# EAGLE design powerSupplyBoard_new (EAGLE 8.0.0)
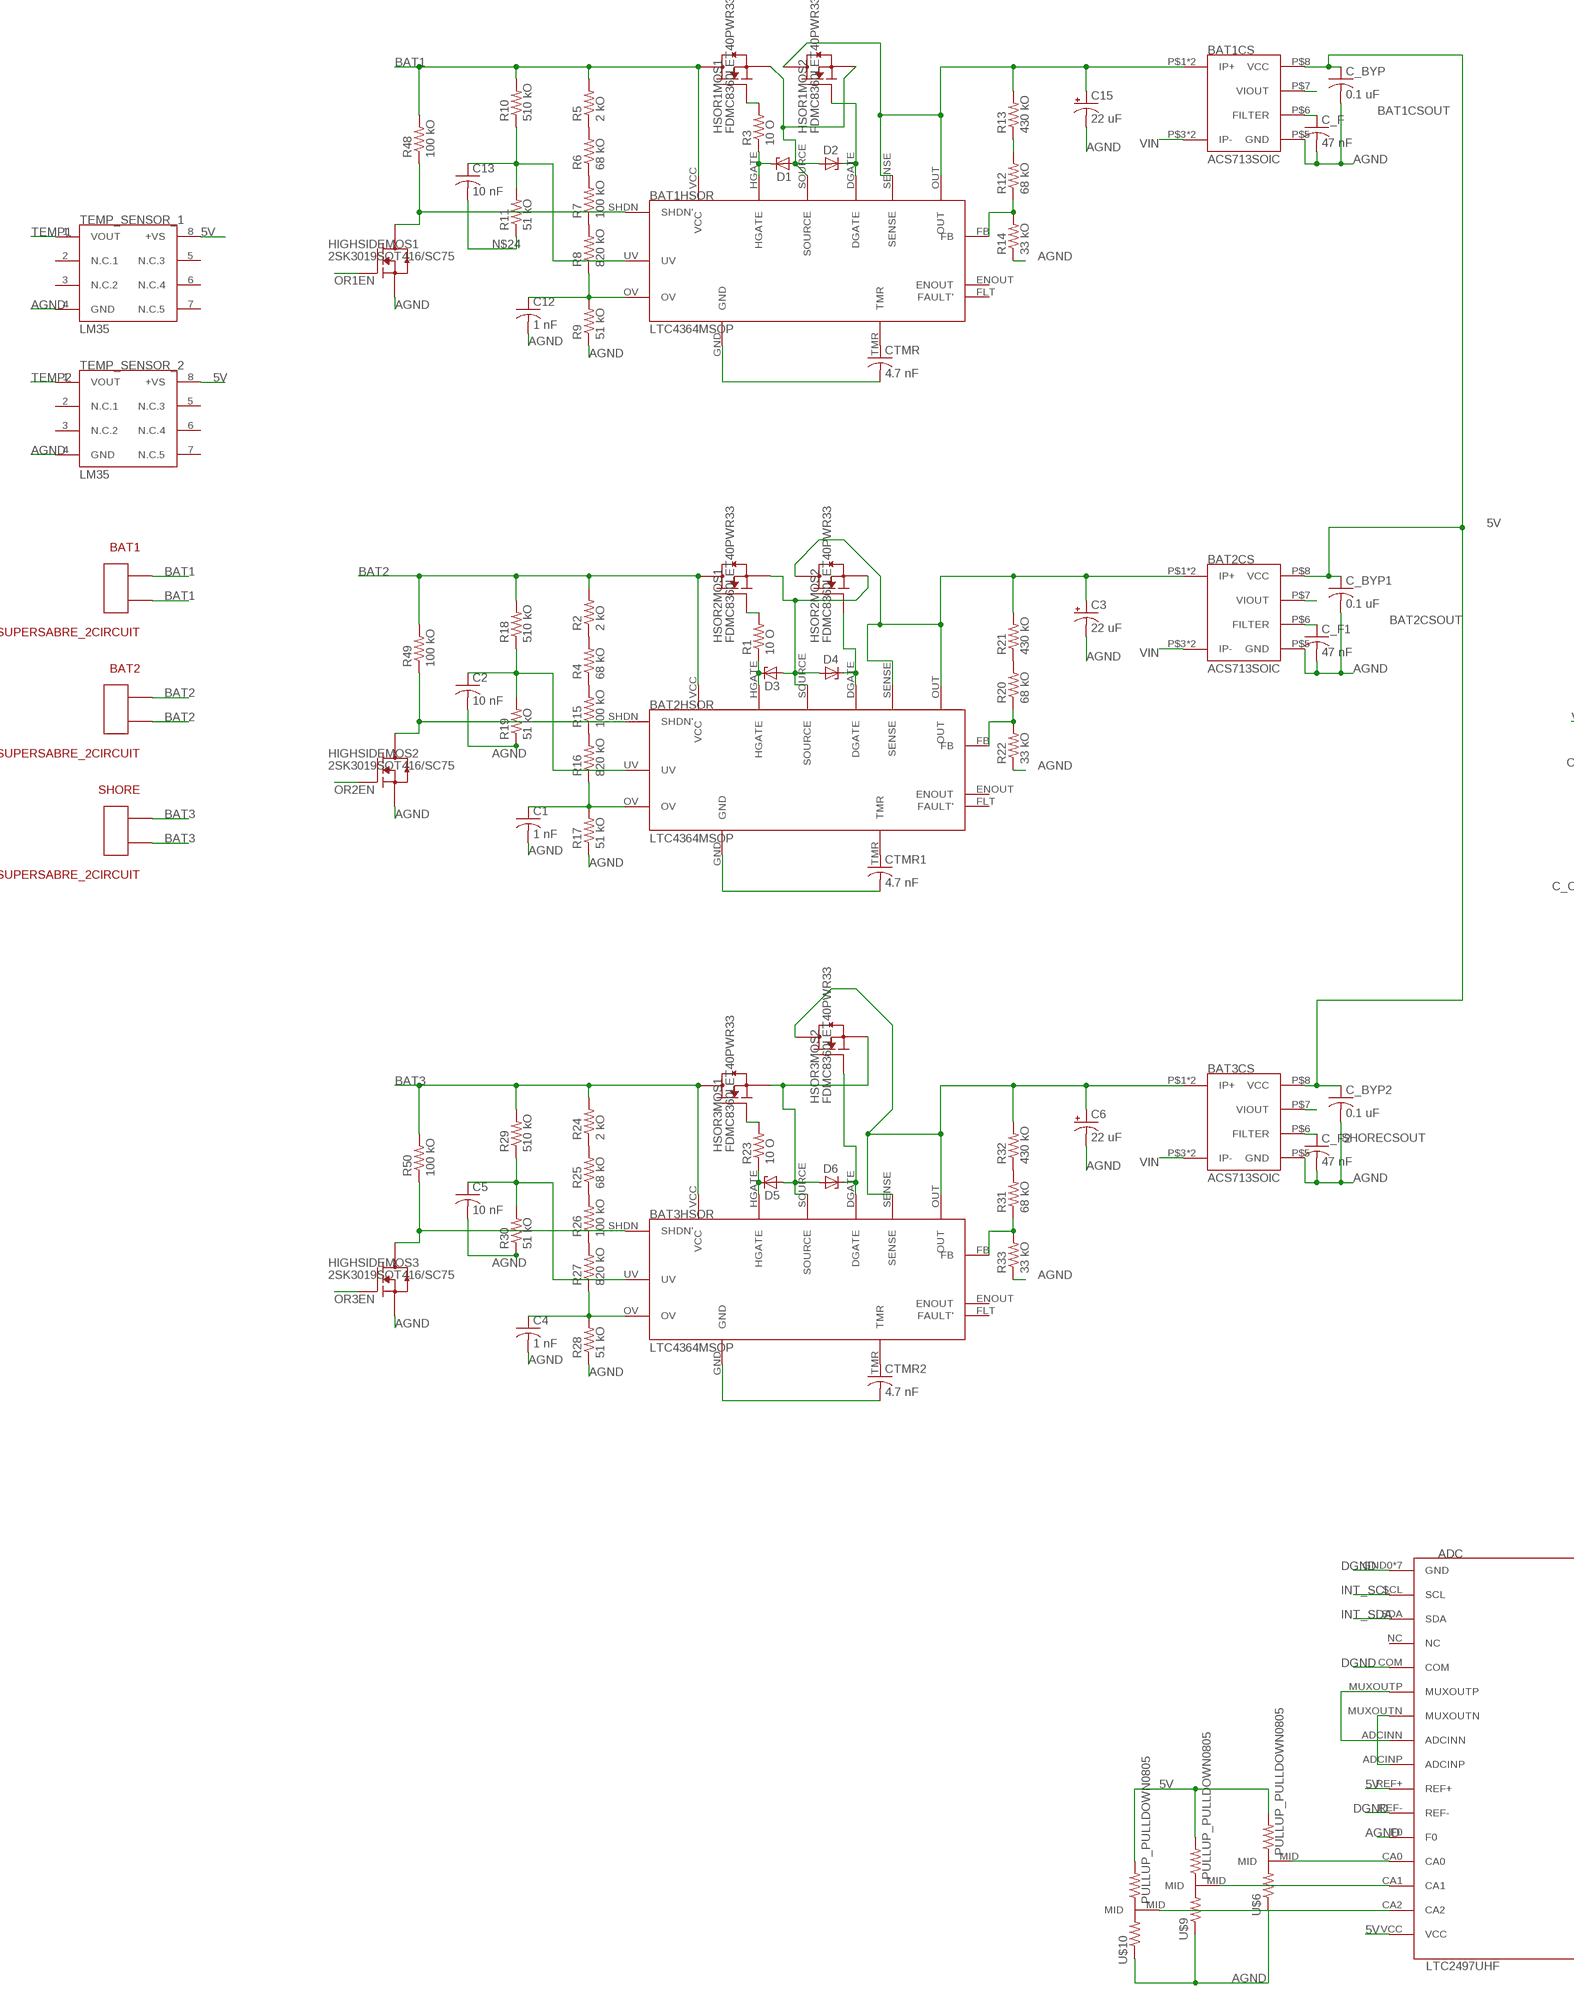
[diagram p0: schematic, sheet 1, part 1 of 2]
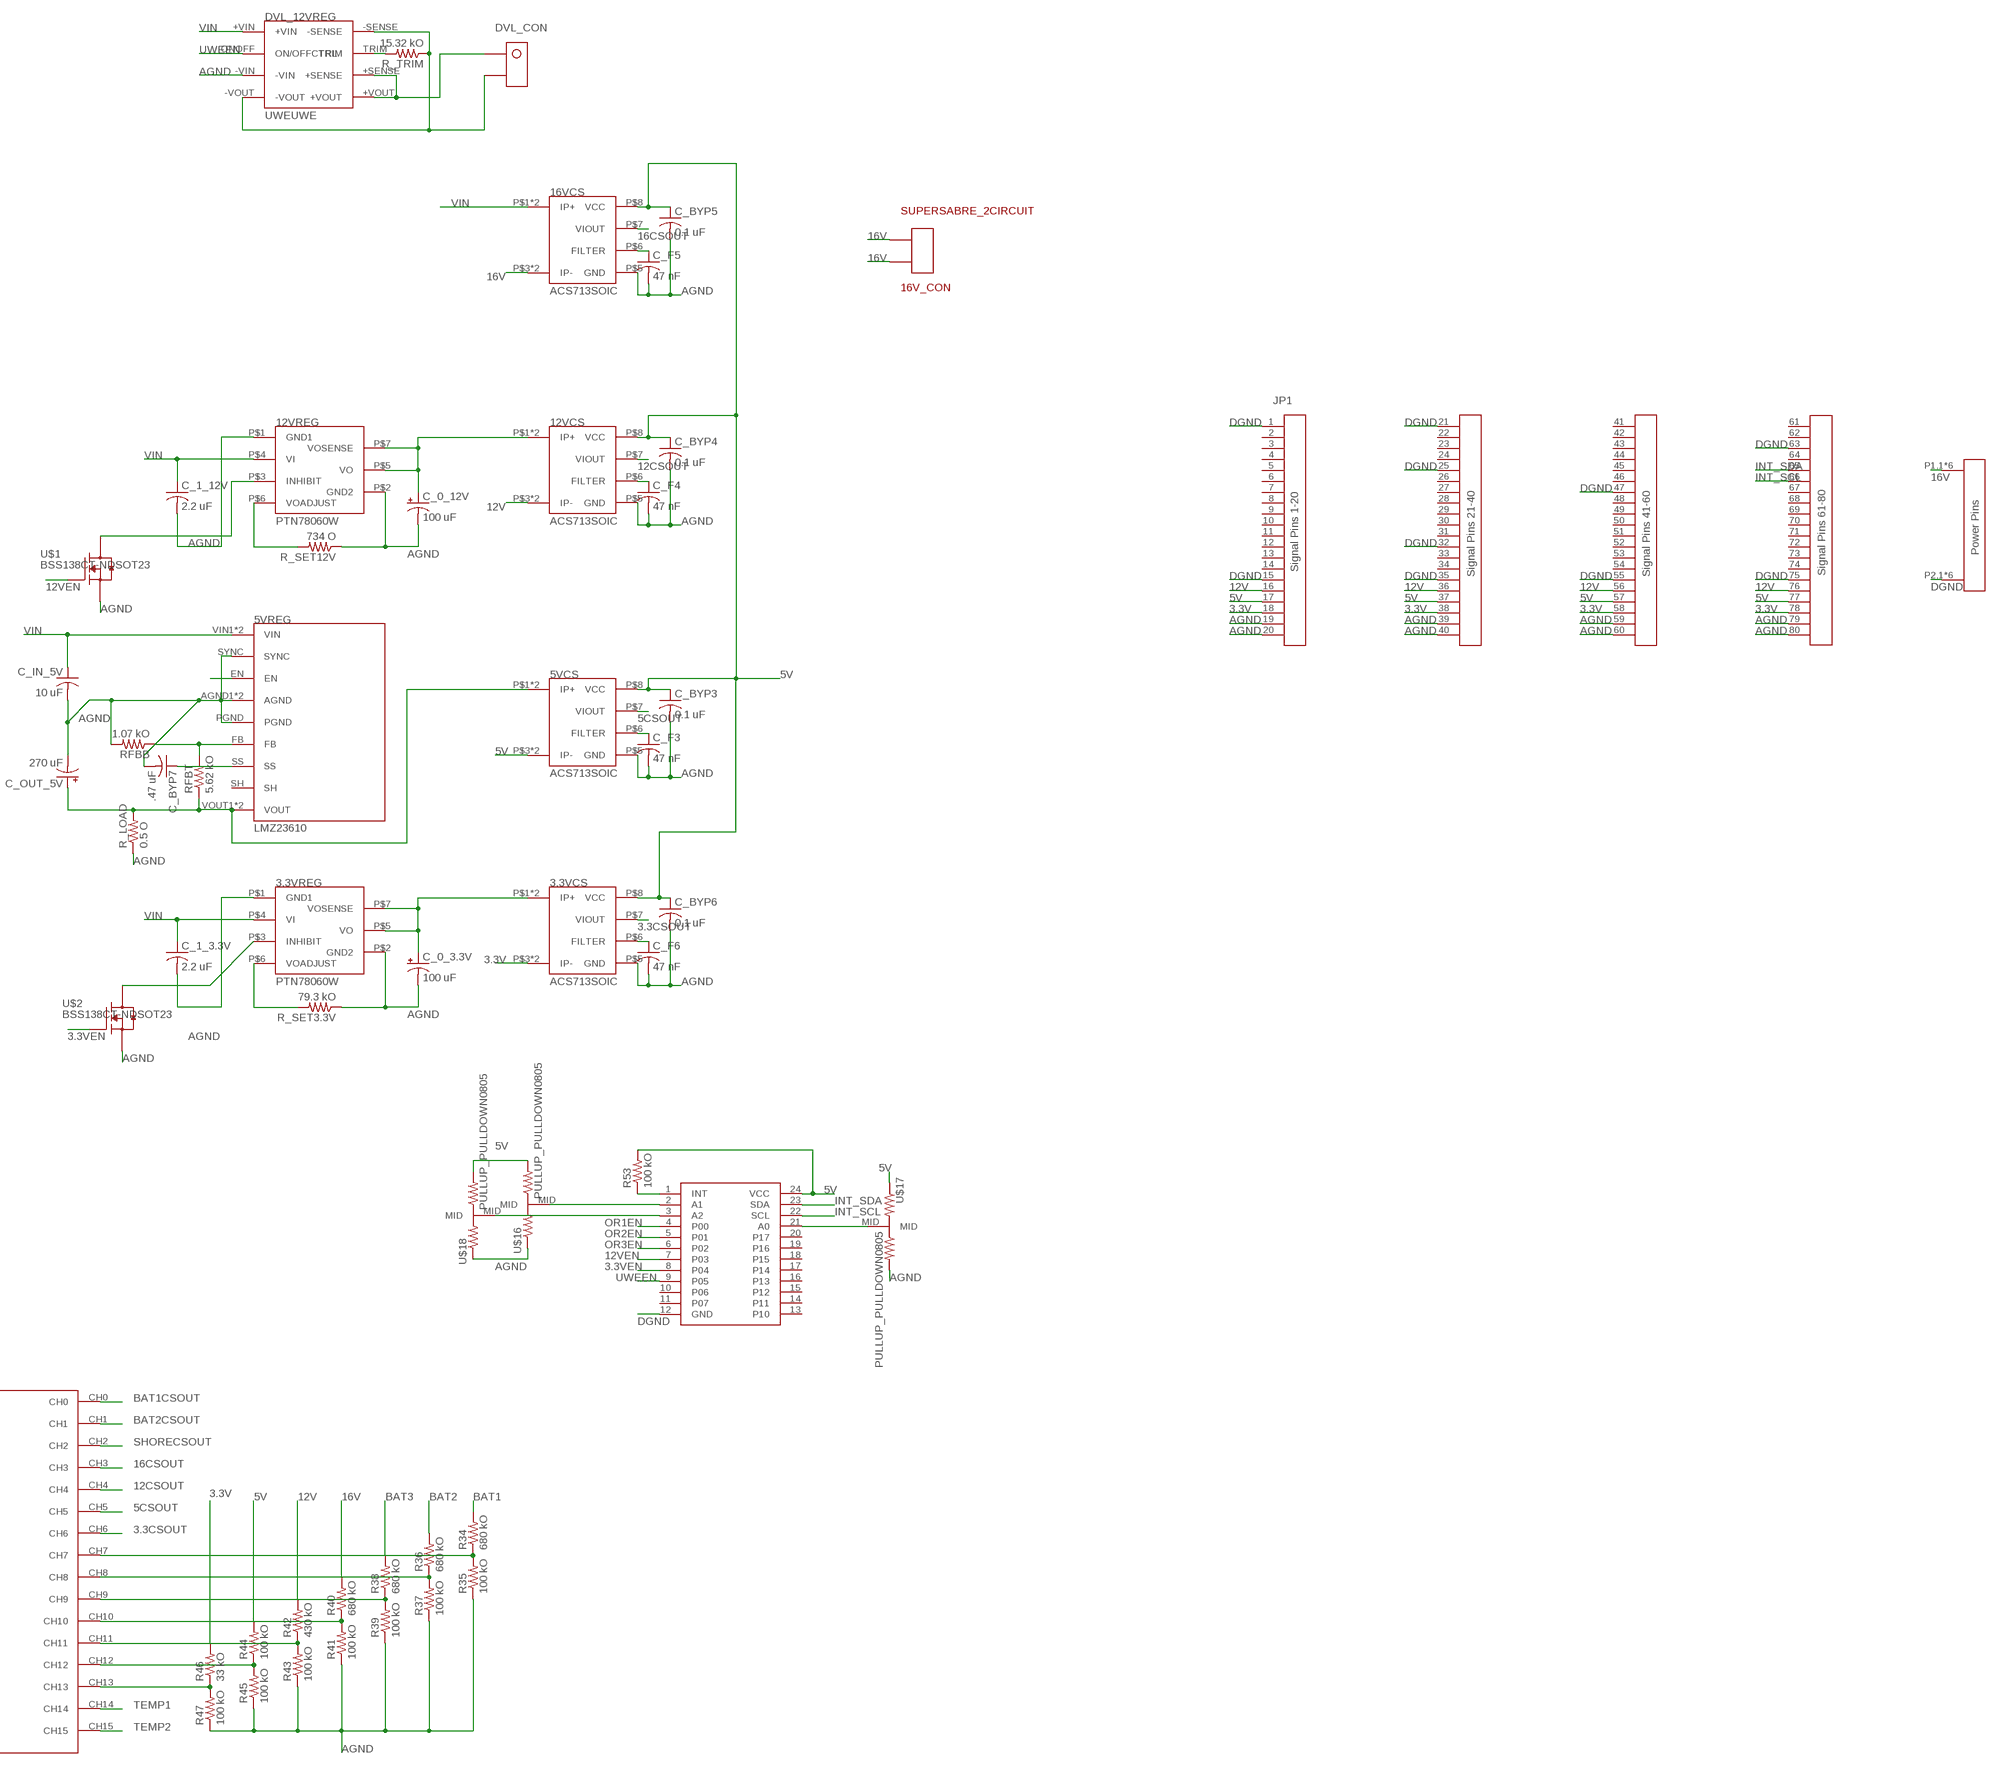
[diagram p1: schematic, sheet 1, part 2 of 2]

## Parts
3.3VCS  ACS713SOIC  [ACS713-SOIC]
3.3VREG  PTN78060W  [PTN78060W]
5VCS  ACS713SOIC  [ACS713-SOIC]
5VREG  LMZ23610  [LMZ23610]
12VCS  ACS713SOIC  [ACS713-SOIC]
12VREG  PTN78060W  [PTN78060W]
16V_CON  SUPERSABRE_2CIRCUIT  [SUPERSABRE_2CIRCUIT]
16VCS  ACS713SOIC  [ACS713-SOIC]
ADC  LTC2497UHF  [LTC2497-UHF]
BAT1  SUPERSABRE_2CIRCUIT  [SUPERSABRE_2CIRCUIT]
BAT1CS  ACS713SOIC  [ACS713-SOIC]
BAT1HSOR  LTC4364MSOP  [MSOP16]
BAT2  SUPERSABRE_2CIRCUIT  [SUPERSABRE_2CIRCUIT]
BAT2CS  ACS713SOIC  [ACS713-SOIC]
BAT2HSOR  LTC4364MSOP  [MSOP16]
BAT3CS  ACS713SOIC  [ACS713-SOIC]
BAT3HSOR  LTC4364MSOP  [MSOP16]
C1  1 nF  C-USC0805  [C0805]
C2  10 nF  C-USC0805  [C0805]
C3  22 uF  CPOL-USF  [PANASONIC_F]
C4  1 nF  C-USC0805  [C0805]
C5  10 nF  C-USC0805  [C0805]
C6  22 uF  CPOL-USF  [PANASONIC_F]
C12  1 nF  C-USC0805  [C0805]
C13  10 nF  C-USC0805  [C0805]
C15  22 uF  CPOL-USF  [PANASONIC_F]
C_0_3.3V  100 uF  CPOL-USF  [PANASONIC_F]
C_0_12V  100 uF  CPOL-USF  [PANASONIC_F]
C_1_3.3V  2.2 uF  C-USC0805  [C0805]
C_1_12V  2.2 uF  C-USC0805  [C0805]
C_BYP  0.1 uF  C-USC0805  [C0805]
C_BYP1  0.1 uF  C-USC0805  [C0805]
C_BYP2  0.1 uF  C-USC0805  [C0805]
C_BYP3  0.1 uF  C-USC0805  [C0805]
C_BYP4  0.1 uF  C-USC0805  [C0805]
C_BYP5  0.1 uF  C-USC0805  [C0805]
C_BYP6  0.1 uF  C-USC0805  [C0805]
C_BYP7  .47 uF  C-USC0805  [C0805]
C_F  47 nF  C-USC0805  [C0805]
C_F1  47 nF  C-USC0805  [C0805]
C_F2  47 nF  C-USC0805  [C0805]
C_F3  47 nF  C-USC0805  [C0805]
C_F4  47 nF  C-USC0805  [C0805]
C_F5  47 nF  C-USC0805  [C0805]
C_F6  47 nF  C-USC0805  [C0805]
C_IN_5V  10 uF  C-USC0805  [C0805]
C_OUT_5V  270 uF  CPOL-USF  [PANASONIC_F]
CTMR  4.7 nF  C-USC0805  [C0805]
CTMR1  4.7 nF  C-USC0805  [C0805]
CTMR2  4.7 nF  C-USC0805  [C0805]
D1  ZENER-DIODESOD323-W  [SOD323-W]
D2  ZENER-DIODESOD323-W  [SOD323-W]
D3  ZENER-DIODESOD323-W  [SOD323-W]
D4  ZENER-DIODESOD323-W  [SOD323-W]
D5  ZENER-DIODESOD323-W  [SOD323-W]
D6  ZENER-DIODESOD323-W  [SOD323-W]
DVL_12VREG  UWEUWE  [UWE]
DVL_CON  KK254_VERT_2PIN22-29-2021  [KK254_VERT_2PIN]
HIGHSIDEMOS1  2SK3019SOT416/SC75  [SOT416]
HIGHSIDEMOS2  2SK3019SOT416/SC75  [SOT416]
HIGHSIDEMOS3  2SK3019SOT416/SC75  [SOT416]
HSOR1MOS1  FDMC8360LET40PWR33  [POWER33]
HSOR1MOS2  FDMC8360LET40PWR33  [POWER33]
HSOR2MOS1  FDMC8360LET40PWR33  [POWER33]
HSOR2MOS2  FDMC8360LET40PWR33  [POWER33]
HSOR3MOS1  FDMC8360LET40PWR33  [POWER33]
HSOR3MOS2  FDMC8360LET40PWR33  [POWER33]
IOEXPANDER  PCF8575C  [PW_R-PDSO-G24]
JP1  MPSC-01-80MPSC-RA-LC  [MPSC-01-80]
R1  10 O  R-US_R0805  [R0805]
R2  2 kO  R-US_R0805  [R0805]
R3  10 O  R-US_R0805  [R0805]
R4  68 kO  R-US_R0805  [R0805]
R5  2 kO  R-US_R0805  [R0805]
R6  68 kO  R-US_R0805  [R0805]
R7  100 kO  R-US_R0805  [R0805]
R8  820 kO  R-US_R0805  [R0805]
R9  51 kO  R-US_R0805  [R0805]
R10  510 kO  R-US_R0805  [R0805]
R11  51 kO  R-US_R0805  [R0805]
R12  68 kO  R-US_R0805  [R0805]
R13  430 kO  R-US_R0805  [R0805]
R14  33 kO  R-US_R0805  [R0805]
R15  100 kO  R-US_R0805  [R0805]
R16  820 kO  R-US_R0805  [R0805]
R17  51 kO  R-US_R0805  [R0805]
R18  510 kO  R-US_R0805  [R0805]
R19  51 kO  R-US_R0805  [R0805]
R20  68 kO  R-US_R0805  [R0805]
R21  430 kO  R-US_R0805  [R0805]
R22  33 kO  R-US_R0805  [R0805]
R23  10 O  R-US_R0805  [R0805]
R24  2 kO  R-US_R0805  [R0805]
R25  68 kO  R-US_R0805  [R0805]
R26  100 kO  R-US_R0805  [R0805]
R27  820 kO  R-US_R0805  [R0805]
R28  51 kO  R-US_R0805  [R0805]
R29  510 kO  R-US_R0805  [R0805]
R30  51 kO  R-US_R0805  [R0805]
R31  68 kO  R-US_R0805  [R0805]
R32  430 kO  R-US_R0805  [R0805]
R33  33 kO  R-US_R0805  [R0805]
R34  680 kO  R-US_R0805  [R0805]
R35  100 kO  R-US_R0805  [R0805]
R36  680 kO  R-US_R0805  [R0805]
R37  100 kO  R-US_R0805  [R0805]
R38  680 kO  R-US_R0805  [R0805]
R39  100 kO  R-US_R0805  [R0805]
R40  680 kO  R-US_R0805  [R0805]
R41  100 kO  R-US_R0805  [R0805]
R42  430 kO  R-US_R0805  [R0805]
R43  100 kO  R-US_R0805  [R0805]
R44  100 kO  R-US_R0805  [R0805]
R45  100 kO  R-US_R0805  [R0805]
R46  33 kO  R-US_R0805  [R0805]
R47  100 kO  R-US_R0805  [R0805]
R48  100 kO  R-US_R0805  [R0805]
R49  100 kO  R-US_R0805  [R0805]
R50  100 kO  R-US_R0805  [R0805]
R53  100 kO  R-US_R0805  [R0805]
R_LOAD  0.5 O  R-US_R0805  [R0805]
R_SET3.3V  79.3 kO  R-US_R0805  [R0805]
R_SET12V  734 O  R-US_R0805  [R0805]
R_TRIM  15.32 kO  R-US_R0805  [R0805]
RFBB  1.07 kO  R-US_R0805  [R0805]
RFBT  5.62 kO  R-US_R0805  [R0805]
SHORE  SUPERSABRE_2CIRCUIT  [SUPERSABRE_2CIRCUIT]
TEMP_SENSOR_1  LM35  [LM35]
TEMP_SENSOR_2  LM35  [LM35]
U$1  BSS138CT-NDSOT23  [SOT23]
U$2  BSS138CT-NDSOT23  [SOT23]
U$6  PULLUP_PULLDOWN0805  [PULLUP_PULLDOWN_0805]
U$9  PULLUP_PULLDOWN0805  [PULLUP_PULLDOWN_0805]
U$10  PULLUP_PULLDOWN0805  [PULLUP_PULLDOWN_0805]
U$16  PULLUP_PULLDOWN0805  [PULLUP_PULLDOWN_0805]
U$17  PULLUP_PULLDOWN0805  [PULLUP_PULLDOWN_0805]
U$18  PULLUP_PULLDOWN0805  [PULLUP_PULLDOWN_0805]

## Nets
3.3CSOUT: 3.3VCS.P$7(VIOUT) ADC.CH6
3.3V: 3.3VCS.P$3(IP-) 3.3VCS.P$4(IP-) JP1.18 JP1.38 JP1.58 JP1.78 R46.2
3.3VEN: IOEXPANDER.8(P04) U$2.1(G)
5CSOUT: 5VCS.P$7(VIOUT) ADC.CH5
5V: 3.3VCS.P$8(VCC) 5VCS.P$3(IP-) 5VCS.P$4(IP-) 5VCS.P$8(VCC) 12VCS.P$8(VCC) 16VCS.P$8(VCC) ADC.REF+ ADC.VCC BAT1CS.P$8(VCC) BAT2CS.P$8(VCC) BAT3CS.P$8(VCC) C_BYP1.1 C_BYP2.1 C_BYP3.1 C_BYP4.1 C_BYP5.1 C_BYP6.1 C_BYP.1 IOEXPANDER.24(VCC) JP1.17 JP1.37 JP1.57 JP1.77 R44.2 R53.2 TEMP_SENSOR_1.8(+VS) TEMP_SENSOR_2.8(+VS) U$6.VCC(PWR) U$9.VCC(PWR) U$10.VCC(PWR) U$16.VCC(PWR) U$17.GND U$18.VCC(PWR)
12CSOUT: 12VCS.P$7(VIOUT) ADC.CH4
12V: 12VCS.P$3(IP-) 12VCS.P$4(IP-) JP1.16 JP1.36 JP1.56 JP1.76 R42.2
12VEN: IOEXPANDER.7(P03) U$1.1(G)
16CSOUT: 16VCS.P$7(VIOUT) ADC.CH3
16V: 16V_CON.P$1 16V_CON.P$2 16VCS.P$3(IP-) 16VCS.P$4(IP-) JP1.P1,1(POWER1) JP1.P1,2(POWER1) JP1.P1,3(POWER1) JP1.P1,4(POWER1) JP1.P1,5(POWER1) JP1.P1,6(POWER1) R40.2
AGND: 3.3VCS.P$5(GND) 3.3VREG.P$1(GND1) 3.3VREG.P$2(GND2) 5VCS.P$5(GND) 5VREG.AGND1(AGND) 5VREG.AGND2(AGND) 5VREG.PGND 5VREG.SYNC 12VCS.P$5(GND) 12VREG.P$1(GND1) 12VREG.P$2(GND2) 16VCS.P$5(GND) ADC.F0 BAT1CS.P$5(GND) BAT1HSOR.GND BAT2CS.P$5(GND) BAT2HSOR.GND BAT3CS.P$5(GND) BAT3HSOR.GND C1.2 C2.2 C3.- C4.2 C5.2 C6.- C12.2 C15.- C_0_3.3V.- C_0_12V.- C_1_3.3V.2 C_1_12V.2 C_BYP1.2 C_BYP2.2 C_BYP3.2 C_BYP4.2 C_BYP5.2 C_BYP6.2 C_BYP7.2 C_BYP.2 C_F1.2 C_F2.2 C_F3.2 C_F4.2 C_F5.2 C_F6.2 C_F.2 C_IN_5V.2 C_OUT_5V.- CTMR1.2 CTMR2.2 CTMR.2 DVL_12VREG.-VIN HIGHSIDEMOS1.S HIGHSIDEMOS2.S HIGHSIDEMOS3.S JP1.19 JP1.20 JP1.39 JP1.40 JP1.59 JP1.60 JP1.79 JP1.80 R9.1 R14.1 R17.1 R19.1 R22.1 R28.1 R30.1 R33.1 R35.1 R37.1 R39.1 R41.1 R43.1 R45.1 R47.1 R_LOAD.1 R_SET3.3V.1 R_SET12V.1 RFBB.2 TEMP_SENSOR_1.4(GND) TEMP_SENSOR_2.4(GND) U$1.2(S) U$2.2(S) U$6.GND U$9.GND U$10.GND U$16.GND U$17.VCC(PWR) U$18.GND
BAT1: BAT1.P$1 BAT1.P$2 BAT1HSOR.VCC HSOR1MOS1.DRAIN R5.2 R10.2 R34.2 R48.2
BAT1CSOUT: ADC.CH0 BAT1CS.P$7(VIOUT)
BAT1HSOROUT: BAT1CS.P$1(IP+) BAT1CS.P$2(IP+) BAT1HSOR.OUT BAT1HSOR.SENSE C15.+ HSOR1MOS2.DRAIN R13.2
BAT2: BAT2.P$1 BAT2.P$2 BAT2HSOR.VCC HSOR2MOS1.DRAIN R2.2 R18.2 R36.2 R49.2
BAT2CSOUT: ADC.CH1 BAT2CS.P$7(VIOUT)
BAT2HSOROUT: BAT2CS.P$1(IP+) BAT2CS.P$2(IP+) BAT2HSOR.OUT BAT2HSOR.SENSE C3.+ HSOR2MOS2.DRAIN R21.2
BAT3: BAT3HSOR.VCC HSOR3MOS1.DRAIN R24.2 R29.2 R38.2 R50.2 SHORE.P$1 SHORE.P$2
BAT3HSOROUT: BAT3CS.P$1(IP+) BAT3CS.P$2(IP+) BAT3HSOR.OUT BAT3HSOR.SENSE C6.+ HSOR3MOS2.DRAIN R32.2
DGND: ADC.COM ADC.GND0(GND) ADC.GND1(GND) ADC.GND2(GND) ADC.GND3(GND) ADC.GND4(GND) ADC.GND5(GND) ADC.GND6(GND) ADC.REF- IOEXPANDER.12(GND) JP1.1 JP1.15 JP1.21 JP1.25 JP1.32 JP1.35 JP1.47 JP1.55 JP1.63 JP1.75 JP1.P2,1(POWER2) JP1.P2,2(POWER2) JP1.P2,3(POWER2) JP1.P2,4(POWER2) JP1.P2,5(POWER2) JP1.P2,6(POWER2)
INT_SCL: ADC.SCL IOEXPANDER.22(SCL) JP1.66
INT_SDA: ADC.SDA IOEXPANDER.23(SDA) JP1.65
N$2: BAT2HSOR.HGATE D3.C R1.1
N$3: HSOR1MOS1.GATE R3.2
N$4: BAT2HSOR.DGATE D4.C HSOR2MOS2.GATE
N$6: R2.1 R4.2
N$7: BAT1HSOR.HGATE D1.C R3.1
N$8: R5.1 R6.2
N$9: BAT1HSOR.DGATE D2.C HSOR1MOS2.GATE
N$10: R4.1 R15.2
N$11: BAT3HSOR.SOURCE D5.A D6.A HSOR3MOS1.SOURCE1(SOURCE) HSOR3MOS1.SOURCE2(SOURCE) HSOR3MOS1.SOURCE3(SOURCE) HSOR3MOS2.SOURCE1(SOURCE) HSOR3MOS2.SOURCE2(SOURCE) HSOR3MOS2.SOURCE3(SOURCE)
N$12: R6.1 R7.2
N$13: R7.1 R8.2
N$14: BAT1HSOR.OV C12.1 R8.1 R9.2
N$15: BAT1HSOR.UV C13.1 R10.1 R11.2
N$16: R12.2 R13.1
N$17: BAT1HSOR.FB R12.1 R14.2
N$18: R15.1 R16.2
N$19: BAT2HSOR.OV C1.1 R16.1 R17.2
N$20: BAT1HSOR.TMR CTMR.1
N$21: BAT2HSOR.UV C2.1 R18.1 R19.2
N$22: R20.2 R21.1
N$23: BAT2HSOR.FB R20.1 R22.2
N$24: C13.2 R11.1
N$25: BAT1CS.P$6(FILTER) C_F.1
N$26: BAT2HSOR.TMR CTMR1.1
N$27: BAT2HSOR.SOURCE D3.A D4.A HSOR2MOS1.SOURCE1(SOURCE) HSOR2MOS1.SOURCE2(SOURCE) HSOR2MOS1.SOURCE3(SOURCE) HSOR2MOS2.SOURCE1(SOURCE) HSOR2MOS2.SOURCE2(SOURCE) HSOR2MOS2.SOURCE3(SOURCE)
N$28: HSOR2MOS1.GATE R1.2
N$29: BAT2CS.P$6(FILTER) C_F1.1
N$30: BAT3HSOR.HGATE D5.C R23.1
N$31: BAT3HSOR.DGATE D6.C HSOR3MOS2.GATE
N$32: ADC.CH7 R34.1 R35.2
N$33: R24.1 R25.2
N$34: R25.1 R26.2
N$35: R26.1 R27.2
N$36: BAT3HSOR.OV C4.1 R27.1 R28.2
N$37: BAT3HSOR.UV C5.1 R29.1 R30.2
N$38: R31.2 R32.1
N$39: BAT1HSOR.SHDN(SHDN') HIGHSIDEMOS1.D R48.1
N$40: BAT3HSOR.FB R31.1 R33.2
N$41: 5VREG.EN
N$42: BAT3HSOR.TMR CTMR2.1
N$44: HSOR3MOS1.GATE R23.2
N$45: BAT3CS.P$6(FILTER) C_F2.1
N$46: 5VCS.P$1(IP+) 5VCS.P$2(IP+) 5VREG.VOUT1(VOUT) 5VREG.VOUT2(VOUT) C_OUT_5V.+ R_LOAD.2 RFBT.1
N$47: 5VCS.P$6(FILTER) C_F3.1
N$48: 3.3VCS.P$1(IP+) 3.3VCS.P$2(IP+) 3.3VREG.P$5(VO) 3.3VREG.P$7(VOSENSE) C_0_3.3V.+
N$49: 12VCS.P$6(FILTER) C_F4.1
N$50: 12VCS.P$1(IP+) 12VCS.P$2(IP+) 12VREG.P$5(VO) 12VREG.P$7(VOSENSE) C_0_12V.+
N$51: 16VCS.P$6(FILTER) C_F5.1
N$52: DVL_12VREG.+SENSE DVL_12VREG.+VOUT DVL_CON.P$1
N$53: 3.3VCS.P$6(FILTER) C_F6.1
N$54: DVL_12VREG.-SENSE DVL_12VREG.-VOUT DVL_CON.P$2 R_TRIM.1
N$55: ADC.CH8 R36.1 R37.2
N$56: BAT3HSOR.SHDN(SHDN') HIGHSIDEMOS3.D R50.1
N$57: 5VREG.FB RFBB.1 RFBT.2
N$59: BAT2HSOR.SHDN(SHDN') HIGHSIDEMOS2.D R49.1
N$62: DVL_12VREG.TRIM R_TRIM.2
N$64: ADC.ADCINN ADC.MUXOUTP
N$65: ADC.ADCINP ADC.MUXOUTN
N$66: ADC.CH9 R38.1 R39.2
N$67: ADC.CA2 U$10.MID
N$68: BAT1HSOR.SOURCE D1.A D2.A HSOR1MOS1.SOURCE1(SOURCE) HSOR1MOS1.SOURCE2(SOURCE) HSOR1MOS1.SOURCE3(SOURCE) HSOR1MOS2.SOURCE1(SOURCE) HSOR1MOS2.SOURCE2(SOURCE) HSOR1MOS2.SOURCE3(SOURCE)
N$69: ADC.CA0 U$6.MID
N$70: ADC.CA1 U$9.MID
N$71: ADC.CH10 R40.1 R41.2
N$72: ADC.CH11 R42.1 R43.2
N$73: ADC.CH12 R44.1 R45.2
N$74: ADC.CH13 R46.1 R47.2
N$83: 3.3VREG.P$6(VOADJUST) R_SET3.3V.2
N$87: 12VREG.P$3(INHIBIT) U$1.3(D)
N$88: IOEXPANDER.21(A0) U$17.MID
N$89: 3.3VREG.P$3(INHIBIT) U$2.3(D)
N$90: 12VREG.P$6(VOADJUST) R_SET12V.2
N$92: 5VREG.SS C_BYP7.1
N$95: IOEXPANDER.1(INT) R53.1
N$96: IOEXPANDER.2(A1) U$16.MID
N$97: IOEXPANDER.3(A2) U$18.MID
OR1EN: HIGHSIDEMOS1.G IOEXPANDER.4(P00)
OR2EN: HIGHSIDEMOS2.G IOEXPANDER.5(P01)
OR3EN: HIGHSIDEMOS3.G IOEXPANDER.6(P02)
SHORECSOUT: ADC.CH2 BAT3CS.P$7(VIOUT)
TEMP1: ADC.CH14 TEMP_SENSOR_1.1(VOUT)
TEMP2: ADC.CH15 TEMP_SENSOR_2.1(VOUT)
UWEEN: DVL_12VREG.ONOFF(ON/OFFCTRL) IOEXPANDER.9(P05)
VIN: 3.3VREG.P$4(VI) 5VREG.VIN1(VIN) 5VREG.VIN2(VIN) 12VREG.P$4(VI) 16VCS.P$1(IP+) 16VCS.P$2(IP+) BAT1CS.P$3(IP-) BAT1CS.P$4(IP-) BAT2CS.P$3(IP-) BAT2CS.P$4(IP-) BAT3CS.P$3(IP-) BAT3CS.P$4(IP-) C_1_3.3V.1 C_1_12V.1 C_IN_5V.1 DVL_12VREG.+VIN
Unconnected: 5VREG.SH ADC.NC BAT1HSOR.ENOUT BAT1HSOR.FLT(FAULT') BAT2HSOR.ENOUT BAT2HSOR.FLT(FAULT') BAT3HSOR.ENOUT BAT3HSOR.FLT(FAULT') IOEXPANDER.10(P06) IOEXPANDER.11(P07) IOEXPANDER.13(P10) IOEXPANDER.14(P11) IOEXPANDER.15(P12) IOEXPANDER.16(P13) IOEXPANDER.17(P14) IOEXPANDER.18(P15) IOEXPANDER.19(P16) IOEXPANDER.20(P17) JP1.2 JP1.3 JP1.4 JP1.5 JP1.6 JP1.7 JP1.8 JP1.9 JP1.10 JP1.11 JP1.12 JP1.13 JP1.14 JP1.22 JP1.23 JP1.24 JP1.26 JP1.27 JP1.28 JP1.29 JP1.30 JP1.31 JP1.33 JP1.34 JP1.41 JP1.42 JP1.43 JP1.44 JP1.45 JP1.46 JP1.48 JP1.49 JP1.50 JP1.51 JP1.52 JP1.53 JP1.54 JP1.61 JP1.62 JP1.64 JP1.67 JP1.68 JP1.69 JP1.70 JP1.71 JP1.72 JP1.73 JP1.74 TEMP_SENSOR_1.2(N.C.1) TEMP_SENSOR_1.3(N.C.2) TEMP_SENSOR_1.5(N.C.3) TEMP_SENSOR_1.6(N.C.4) TEMP_SENSOR_1.7(N.C.5) TEMP_SENSOR_2.2(N.C.1) TEMP_SENSOR_2.3(N.C.2) TEMP_SENSOR_2.5(N.C.3) TEMP_SENSOR_2.6(N.C.4) TEMP_SENSOR_2.7(N.C.5)

## Library data of the parts
3.3VCS 5VCS 12VCS 16VCS BAT1CS BAT2CS BAT3CS = allegro:ACS713
3.3VREG 12VREG = texas:PTN78060W
5VREG = texas:LMZ23610
16V_CON BAT1 BAT2 SHORE = molex:SUPERSABRE_2CIRCUIT
ADC = linear:LTC2497
BAT1HSOR BAT2HSOR BAT3HSOR = linear:LTC4364
C1 C2 C4 C5 C12 C13 C_1_3.3V C_1_12V C_BYP C_BYP1-C_BYP7 C_F C_F1-C_F6 C_IN_5V CTMR CTMR1 CTMR2 = resistor:C-US: CAPACITOR, American symbol
C3 C6 C15 C_0_3.3V C_0_12V C_OUT_5V = resistor:CPOL-US: POLARIZED CAPACITOR, American symbol
D1-D6 = diode:ZENER-DIODE: Z-Diode
DVL_12VREG = murata:UWE
DVL_CON = molex:KK254_VERT_2PIN: KK® 254 Wire-to-Board Header, Vertical, with Friction Lock, 2 Circuits, Gold (Au) Plating Part Number: 22-29-2021 http://www.molex.com/molex/products/datasheet.jsp?part=active/0022292021_PCB_HEADERS.xml
HIGHSIDEMOS1-HIGHSIDEMOS3 = transistor-fet:2SK3019
HSOR1MOS1 HSOR1MOS2 HSOR2MOS1 HSOR2MOS2 HSOR3MOS1 HSOR3MOS2 = fairchild:FDMC8360LET40
IOEXPANDER = texas:PCF8575C: Remote 16 Bit I2C IO Expander
JP1 = samtec:MPSC-01-80
R1-R50 R53 R_LOAD R_SET3.3V R_SET12V R_TRIM RFBB RFBT = resistor:R-US_: RESISTOR, American symbol
TEMP_SENSOR_1 TEMP_SENSOR_2 = Jameco:LM35
U$1 U$2 = transistor-fet:BSS138CT-ND
U$6 U$9 U$10 U$16-U$18 = resistor:PULLUP_PULLDOWN

## Board
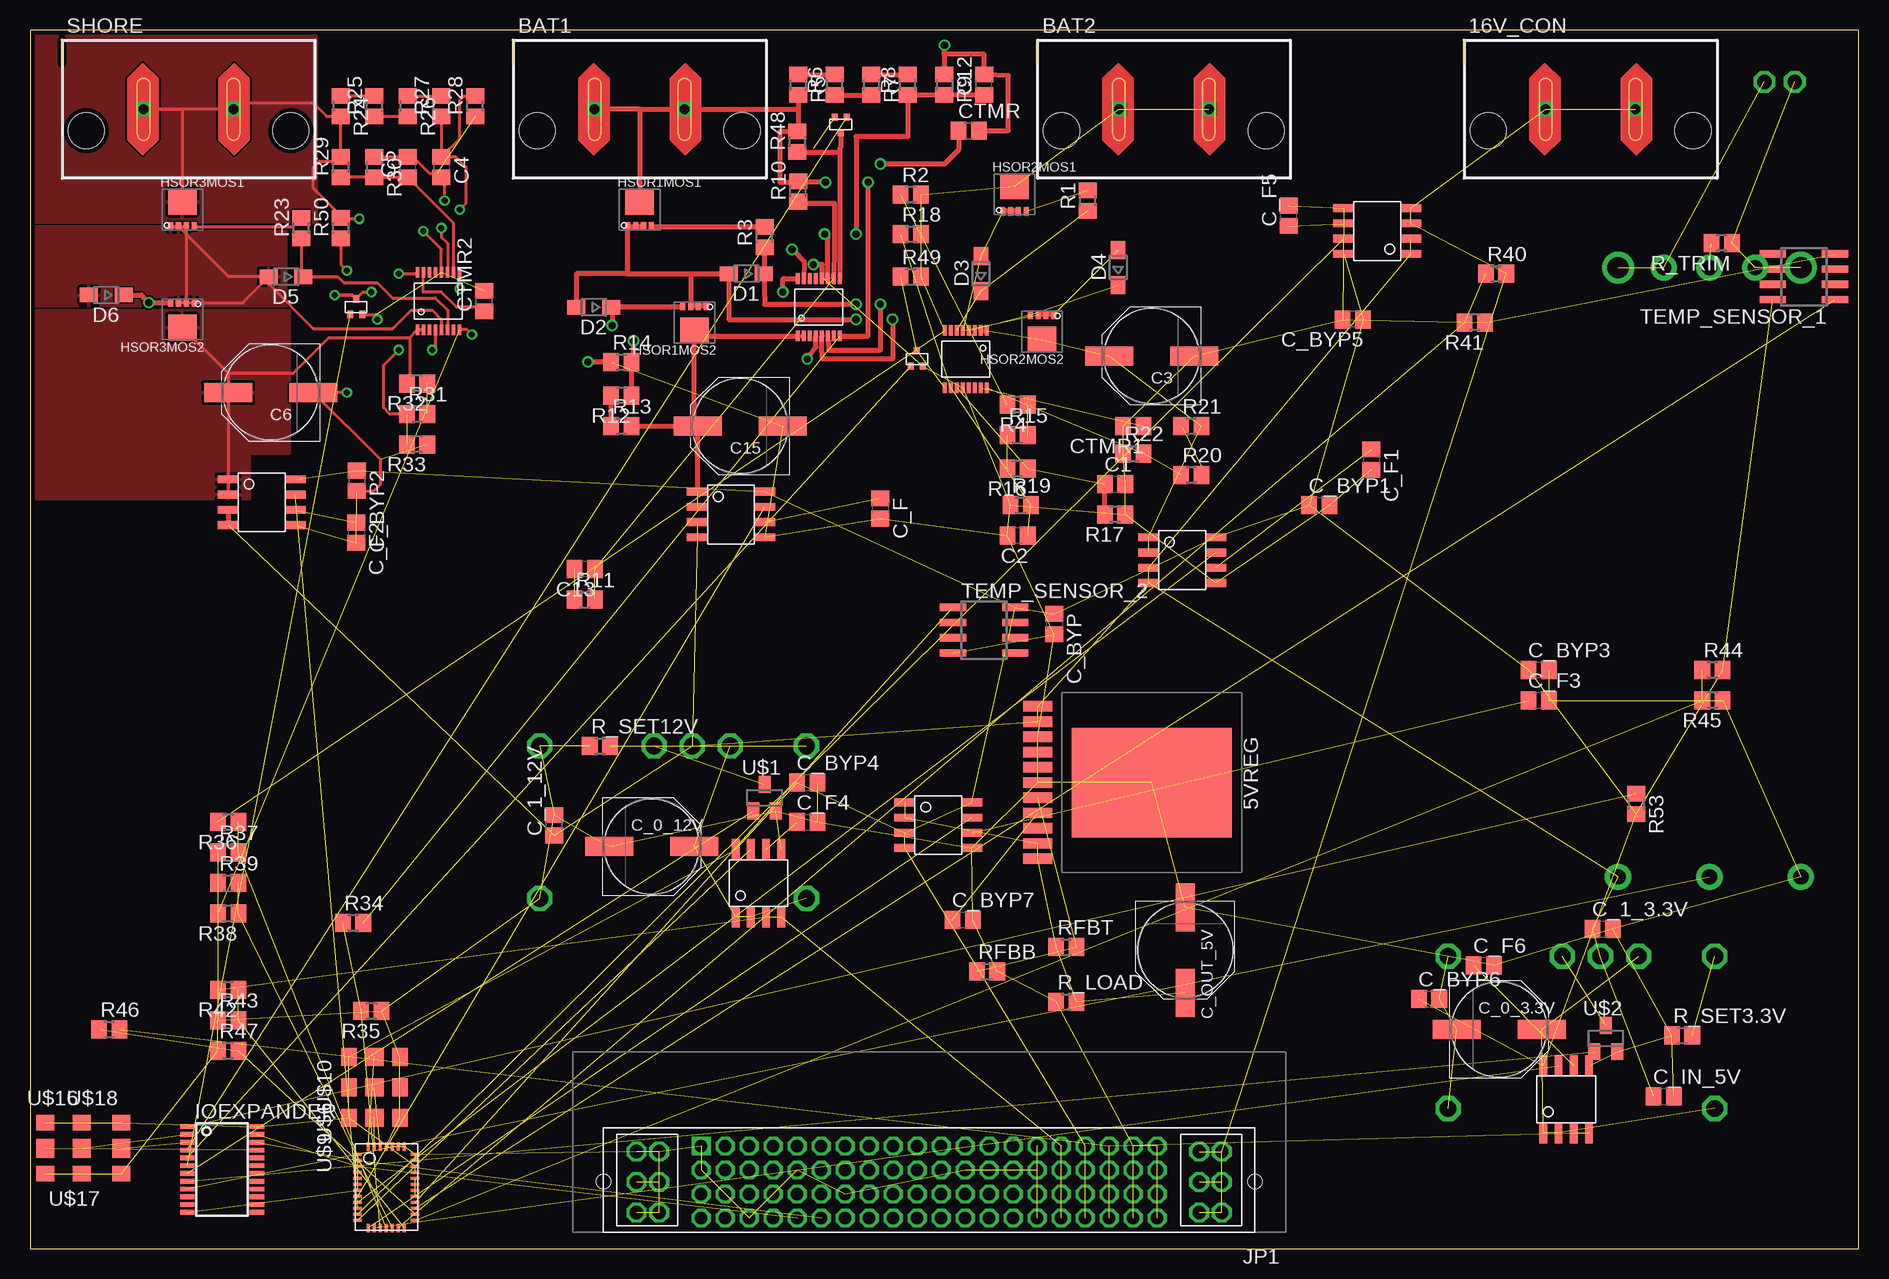
[diagram p2: board, top side]
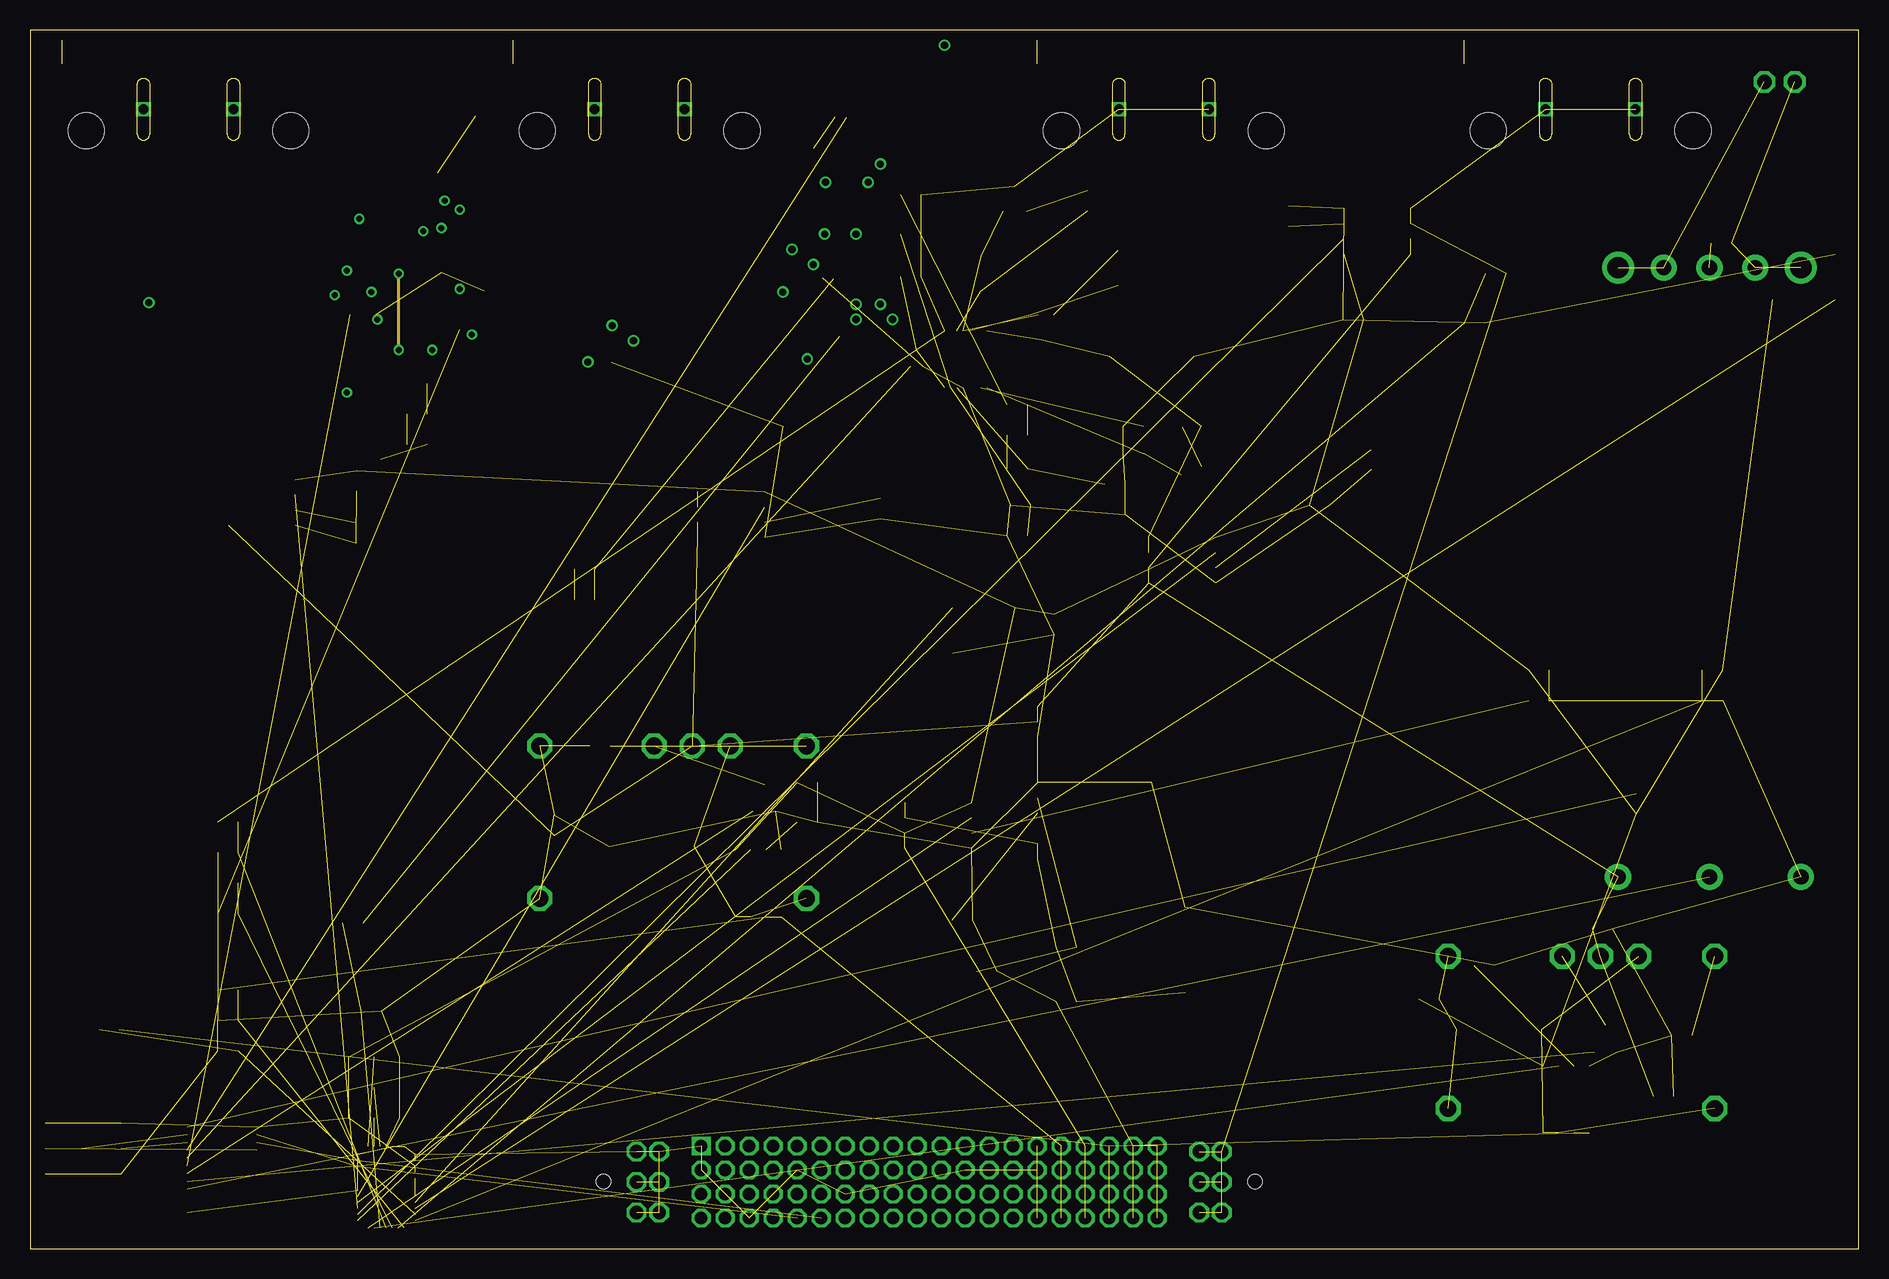
[diagram p3: board, inner layer Route2]
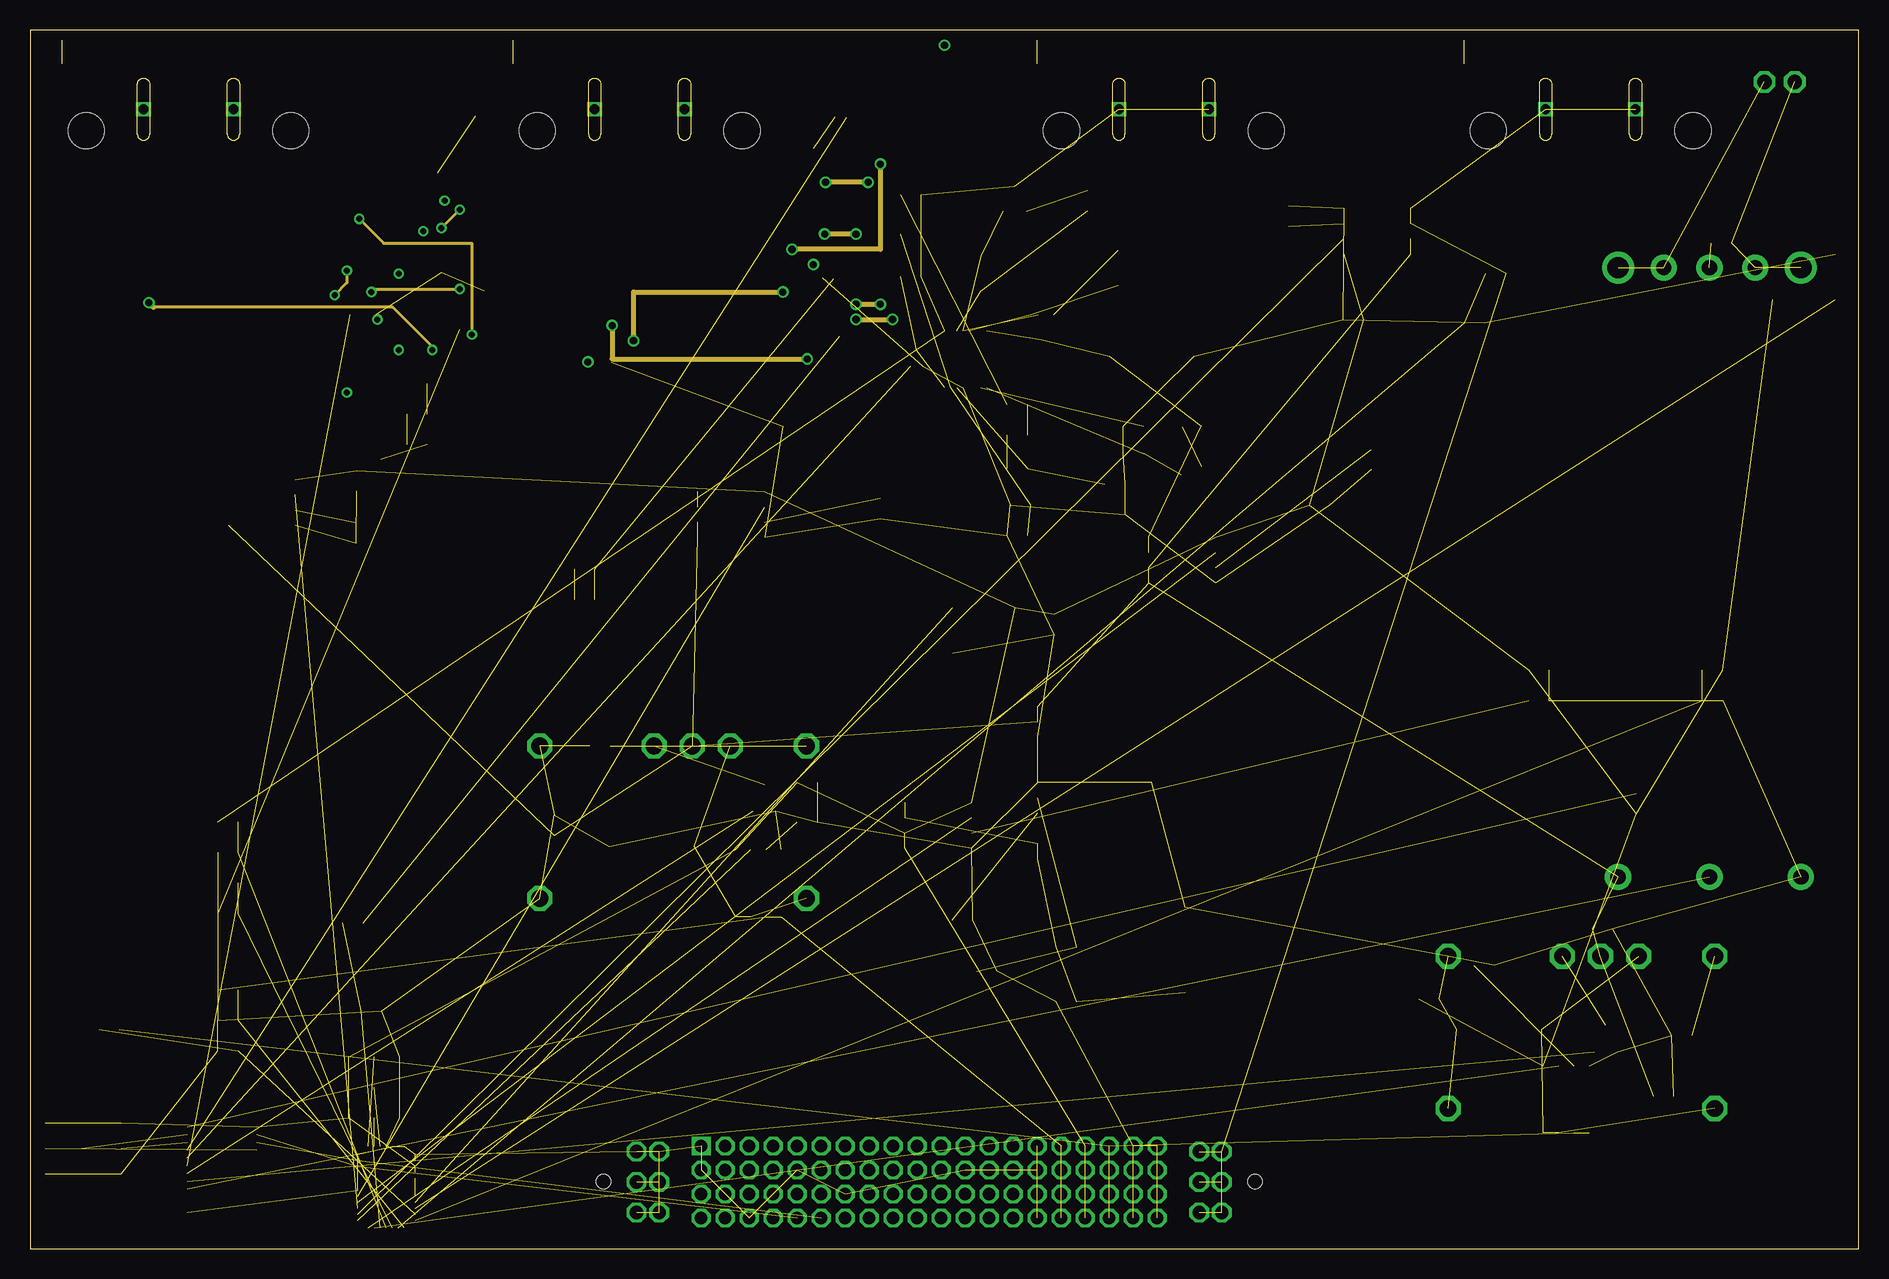
[diagram p4: board, inner layer Route15]
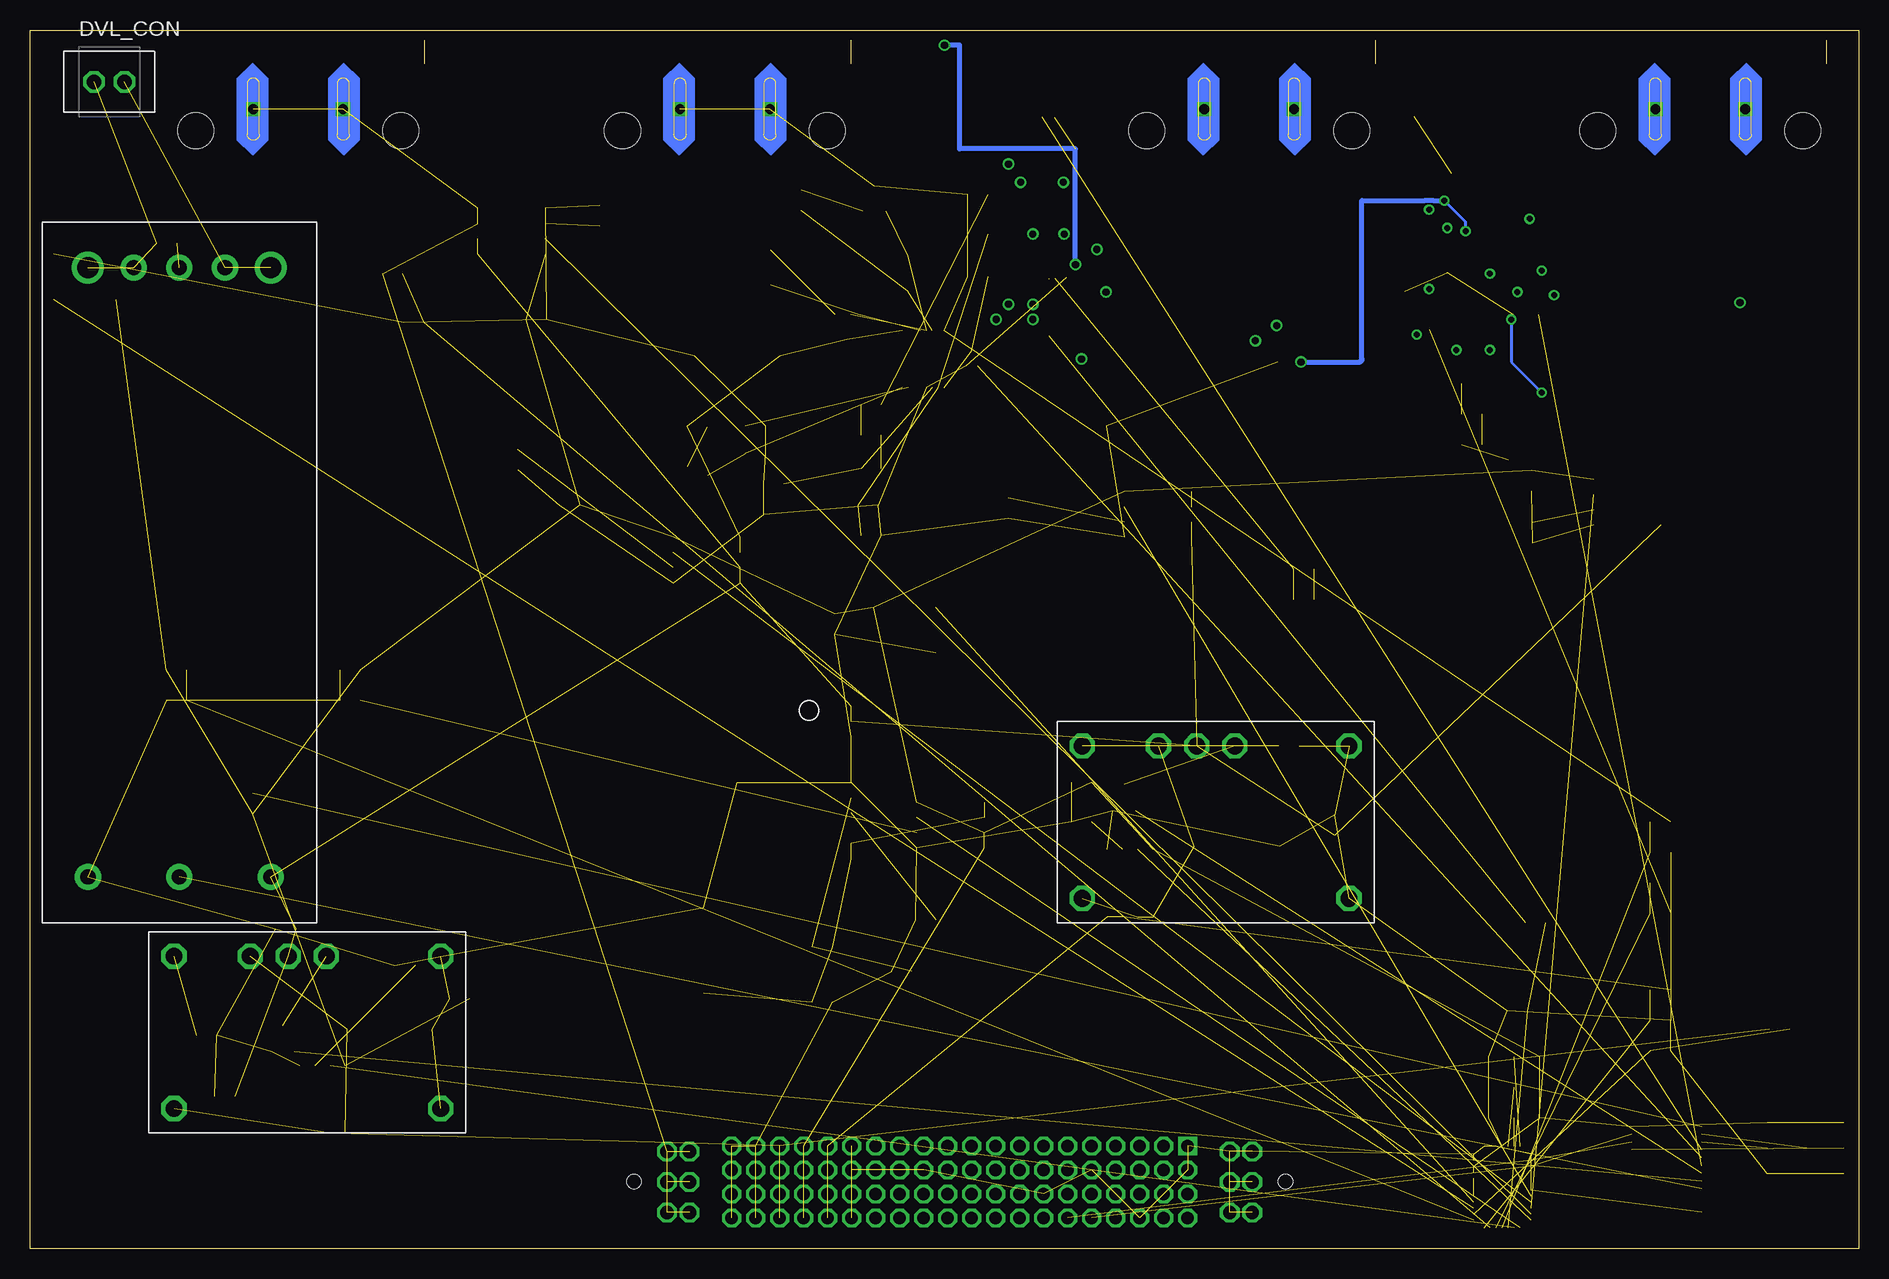
[diagram p5: board, bottom side, seen from below]

Size 152.4 x 101.6 mm. Coordinates in mm from the lower left corner, seen from the top.
Outline: 0,0 152.4,0 152.4,101.6 0,101.6 0,0
Copper layers (1+2*15+16): Top 0.0356mm / dielectric 9.5mil / Route2 0.0356mm / dielectric 39mil / Route15 0.0356mm / dielectric 9.5mil / Bottom 0.0356mm
Design rules "OshPark *": minimum track width 6mil, minimum drill 13mil, track to track 6mil, track to pad 6mil, pad to pad 6mil, via to via 6mil, smd to smd 6mil, copper to edge 15mil, drill to drill 6mil, minimum pad ring 7mil, minimum via ring 7mil, stop-mask expansion 3mil, vias tented up to drill 0mil, thermal gap 10mil

### Footprints (pad centres in the part's own frame; a part is rotated, then mirrored left to right if it is on the bottom)
ACS713-SOIC = smd 0.65 x 1.75: P$1 -1.905,-2.8; P$2 -0.635,-2.8; P$3 0.635,-2.8; P$4 1.905,-2.8; P$5 1.905,2.8; P$6 0.635,2.8; P$7 -0.635,2.8; P$8 -1.905,2.8
PTN78060W = drill 1.397 octagon: P$1 -11.113,6.35; P$2 -11.113,-6.35; P$3 -1.587,-6.35; P$4 1.587,-6.35; P$5 4.763,-6.35; P$6 11.113,-6.35; P$7 11.113,6.35
LMZ23610 = smd 0.86 x 2.41: AGND1 -1.27,-9.5; AGND2 0,-9.5; EN -2.54,-9.5; FB 1.27,-9.5; SH 3.81,-9.5; SS 2.54,-9.5; SYNC -3.81,-9.5; VIN1 -6.35,-9.5; VIN2 -5.08,-9.5; VOUT1 5.08,-9.5; VOUT2 6.35,-9.5 | smd 9.126 x 13.36: PGND 0,0
SUPERSABRE_2CIRCUIT = drill 0.8 square: P$1 -3.747,0; P$2 3.747,0 | hole 2.997: -8.534,-1.803; 8.534,-1.803
LTC2497-UHF = smd 0.25 x 0.7: ADCINN -0.25,2.4; ADCINP 0.25,2.4; CH0 0.75,-2.4; CH1 1.25,-2.4; CH2 1.75,-2.4; CH3 2.25,-2.4; CH4 2.75,-2.4; CH12 2.75,2.4; CH13 2.25,2.4; CH14 1.75,2.4; CH15 1.25,2.4; COM 0.25,-2.4; GND0 -2.75,-2.4; GND1 -1.25,-2.4; GND2 -0.25,-2.4; GND3 -2.75,2.4; MUXOUTN -0.75,2.4; MUXOUTP 0.75,2.4; NC -0.75,-2.4; REF+ -1.75,2.4; REF- -2.25,2.4; SCL -2.25,-2.4; SDA -1.75,-2.4; VCC -1.25,2.4 | smd 0.7 x 0.25: CA0 -3.4,-0.5; CA1 -3.4,-1; CA2 -3.4,-1.5; CH5 3.4,-1.5; CH6 3.4,-1; CH7 3.4,-0.5; CH8 3.4,0; CH9 3.4,0.5; CH10 3.4,1; CH11 3.4,1.5; F0 -3.4,0; GND4 -3.4,0.5; GND5 -3.4,1; GND6 -3.4,1.5
MSOP16 = smd 0.305 x 0.889: DGATE -0.25,-2.39; ENOUT -0.75,2.39; FB -1.75,2.39; FLT -0.25,2.39; GND 0.25,2.39; HGATE 0.75,-2.39; NC -0.75,-2.39; NC1 1.25,-2.39; OUT -1.75,-2.39; OV 0.75,2.39; SENSE -1.25,-2.39; SHDN 1.75,2.39; SOURCE 0.25,-2.39; TMR -1.25,2.39; UV 1.25,2.39; VCC 1.75,-2.39
C0805 = smd 1.3 x 1.5: 1 -0.85,0; 2 0.85,0
PANASONIC_F = smd 4 x 1.6: + 3.55,0; - -3.55,0
SOD323-W = smd 1.5 x 1.2: A 1.45,0; C -1.45,0
UWE = drill 1.27 pad 2.184: +SENSE 25.4,-3.81; +VIN -25.4,-7.62; -SENSE 25.4,3.81; -VIN -25.4,7.62; ONOFF -25.4,0; TRIM 25.4,0 | drill 1.778 pad 2.54: +VOUT 25.4,-7.62; -VOUT 25.4,7.62
KK254_VERT_2PIN = drill 1.2 octagon: P$1 1.27,0; P$2 -1.27,0
SOT416 = smd 0.5 x 0.6: D 0,0.7; G -0.5,-0.6; S 0.5,-0.6
POWER33 = smd 2.37 x 2.15: DRAIN 0,0.675 | smd 0.42 x 0.7: GATE 0.975,-1.4; SOURCE1 -0.975,-1.4; SOURCE2 -0.325,-1.4; SOURCE3 0.325,-1.4
PW_R-PDSO-G24 = smd 0.4 x 1.2: 1 -3.575,-2.9; 2 -2.925,-2.9; 3 -2.275,-2.9; 4 -1.625,-2.9; 5 -0.975,-2.9; 6 -0.325,-2.9; 7 0.325,-2.9; 8 0.975,-2.9; 9 1.625,-2.9; 10 2.275,-2.9; 11 2.925,-2.9; 12 3.575,-2.9; 13 3.575,2.9; 14 2.925,2.9; 15 2.275,2.9; 16 1.625,2.9; 17 0.975,2.9; 18 0.325,2.9; 19 -0.325,2.9; 20 -0.975,2.9; 21 -1.625,2.9; 22 -2.275,2.9; 23 -2.925,2.9; 24 -3.575,2.9
MPSC-01-80 = drill 1.05 square: 1 19,0.33 | drill 1.05 octagon: 2 17,0.33; 3 15,0.33; 4 13,0.33; 5 11,0.33; 6 9,0.33; 7 7,0.33; 8 5,0.33; 9 3,0.33; 10 1,0.33; 11 -1,0.33; 12 -3,0.33; 13 -5,0.33; 14 -7,0.33; 15 -9,0.33; 16 -11,0.33; 17 -13,0.33; 18 -15,0.33; 19 -17,0.33; 20 -19,0.33; 21 19,2.33; 22 17,2.33; 23 15,2.33; 24 13,2.33; 25 11,2.33; 26 9,2.33; 27 7,2.33; 28 5,2.33; 29 3,2.33; 30 1,2.33; 31 -1,2.33; 32 -3,2.33; 33 -5,2.33; 34 -7,2.33; 35 -9,2.33; 36 -11,2.33; 37 -13,2.33; 38 -15,2.33; 39 -17,2.33; 40 -19,2.33; 41 19,4.33; 42 17,4.33; 43 15,4.33; 44 13,4.33; 45 11,4.33; 46 9,4.33; 47 7,4.33; 48 5,4.33; 49 3,4.33; 50 1,4.33; 51 -1,4.33; 52 -3,4.33; 53 -5,4.33; 54 -7,4.33; 55 -9,4.33; 56 -11,4.33; 57 -13,4.33; 58 -15,4.33; 59 -17,4.33; 60 -19,4.33; 61 19,6.33; 62 17,6.33; 63 15,6.33; 64 13,6.33; 65 11,6.33; 66 9,6.33; 67 7,6.33; 68 5,6.33; 69 3,6.33; 70 1,6.33; 71 -1,6.33; 72 -3,6.33; 73 -5,6.33; 74 -7,6.33; 75 -9,6.33; 76 -11,6.33; 77 -13,6.33; 78 -15,6.33; 79 -17,6.33; 80 -19,6.33 | drill 1.1 octagon: P1,1 -24.385,0.79; P1,2 -22.505,0.79; P1,3 -24.385,3.33; P1,4 -22.505,3.33; P1,5 -24.385,5.87; P1,6 -22.505,5.87; P2,1 24.385,0.789; P2,2 22.505,0.789; P2,3 24.385,3.329; P2,4 22.505,3.329; P2,5 24.385,5.869; P2,6 22.505,5.869 | hole 1.2: -27.145,3.3; 27.145,3.3
R0805 = smd 1.3 x 1.5: 1 -0.85,0; 2 0.85,0
LM35 = smd 0.6 x 2.2: 1 -1.905,-2.6; 2 -0.635,-2.6; 3 0.635,-2.6; 4 1.905,-2.6; 5 1.905,2.6; 6 0.635,2.6; 7 -0.635,2.6; 8 -1.905,2.6
SOT23 = smd 1 x 1.4: 1 -0.95,-1.1; 2 0.95,-1.1; 3 0,1.1
PULLUP_PULLDOWN_0805 = smd 1.5 x 1.3: GND 0,-2.12; VCC 0,2.12 | smd 1.5 x 1.57: MID 0,0

### Placement (x,y rotation side)
3.3VCS  128.02,12.45 0 top
3.3VREG  129.29,18.03 180 bottom
5VCS  75.69,35.31 270 top
5VREG  93.47,38.86 270 top
12VCS  60.71,30.48 0 top
12VREG  53.59,35.56 180 bottom
16V_CON  130.05,95 0 top
16VCS  112.27,84.84 90 top
ADC  29.69,5.13 270 top
BAT1  50.8,95 0 top
BAT1CS  58.42,61.21 270 top
BAT1HSOR  65.73,78.49 0 top
BAT2  94.49,95 0 top
BAT2CS  96.01,57.4 270 top
BAT2HSOR  77.98,74.17 180 top
BAT3CS  19.3,62.23 270 top
BAT3HSOR  34.04,78.99 0 top
C1  90.42,63.75 0 top
C2  82.3,59.44 180 top
C3  93.47,74.42 180 top
C4  34.29,90.17 270 top
C5  31.5,90.17 90 top
C6  20.07,71.37 180 top
C12  79.5,97.03 90 top
C13  46.23,56.64 180 top
C15  59.18,68.58 180 top
C_0_3.3V  122.43,18.29 0 top
C_0_12V  51.82,33.53 0 top
C_1_3.3V  131.06,26.67 0 top
C_1_12V  43.69,35.31 90 top
C_BYP  85.34,52.07 270 top
C_BYP1  107.44,61.98 0 top
C_BYP2  27.24,64.02 270 top
C_BYP3  125.73,48.26 0 top
C_BYP4  64.77,38.86 0 top
C_BYP5  110.24,77.47 180 top
C_BYP6  116.59,20.83 0 top
C_BYP7  77.72,27.43 0 top
C_F  70.87,61.72 270 top
C_F1  111.76,65.79 270 top
C_F2  27.18,59.69 270 top
C_F3  125.73,45.72 0 top
C_F4  64.77,35.56 0 top
C_F5  104.9,86.11 90 top
C_F6  121.16,23.62 0 top
C_IN_5V  136.14,12.7 0 top
C_OUT_5V  96.27,24.89 270 top
CTMR  78.23,93.22 0 top
CTMR1  91.95,68.58 180 top
CTMR2  37.85,78.99 90 top
D1  59.69,81.28 180 top
D2  46.99,78.49 180 top
D3  79.25,81.28 90 top
D4  90.68,81.79 90 top
D5  21.34,81.03 180 top
D6  6.35,79.5 180 top
DVL_12VREG  139.95,56.39 90 bottom
DVL_CON  145.8,97.28 0 bottom
HIGHSIDEMOS1  67.56,93.73 180 top
HIGHSIDEMOS2  73.91,74.17 0 top
HIGHSIDEMOS3  27.18,78.49 0 top
HSOR1MOS1  50.8,86.61 0 top
HSOR1MOS2  55.37,77.22 180 top
HSOR2MOS1  82.04,87.88 0 top
HSOR2MOS2  84.33,76.45 180 top
HSOR3MOS1  12.7,86.61 0 top
HSOR3MOS2  12.7,77.47 180 top
IOEXPANDER  16,6.6 270 top
JP1  74.93,8.89 180 top
R1  88.14,87.38 90 top
R2  73.41,87.88 0 top
R3  61.21,84.33 90 top
R4  82.3,70.36 180 top
R5  64.01,97.03 270 top
R6  67.06,97.03 90 top
R7  70.1,97.03 270 top
R8  73.15,97.03 90 top
R9  76.2,97.03 270 top
R10  64.01,88.14 90 top
R11  46.23,54.1 0 top
R12  49.28,71.12 180 top
R13  49.28,68.58 0 top
R14  49.28,73.91 0 top
R15  82.3,67.82 0 top
R16  82.3,65.02 180 top
R17  90.42,61.21 180 top
R18  73.41,84.58 0 top
R19  82.55,61.98 0 top
R20  96.77,64.52 0 top
R21  96.77,68.58 0 top
R22  91.95,66.29 0 top
R23  22.61,85.09 90 top
R24  25.91,95.25 270 top
R25  28.7,95.25 90 top
R26  31.5,95.25 270 top
R27  34.29,95.25 90 top
R28  37.08,95.25 90 top
R29  25.91,90.17 90 top
R30  28.7,90.17 270 top
R31  32.26,69.6 0 top
R32  32.26,72.14 180 top
R33  32.26,67.06 180 top
R34  26.92,27.18 0 top
R35  28.45,19.81 180 top
R36  16.51,35.56 180 top
R37  16.51,33.02 0 top
R38  16.51,27.94 180 top
R39  16.51,30.48 0 top
R40  122.17,81.28 0 top
R41  120.4,77.22 180 top
R42  16.51,21.59 180 top
R43  16.51,19.05 0 top
R44  140.21,48.26 0 top
R45  140.21,45.72 180 top
R46  6.6,18.29 0 top
R47  16.51,16.51 0 top
R48  63.95,92.29 90 top
R49  73.41,81.03 0 top
R50  25.91,85.09 90 top
R53  133.86,37.08 270 top
R_LOAD  86.36,20.57 0 top
R_SET3.3V  137.67,17.78 0 top
R_SET12V  47.5,41.91 0 top
R_TRIM  140.97,83.82 180 top
RFBB  79.76,23.11 0 top
RFBT  86.36,25.15 0 top
SHORE  13.21,95 0 top
TEMP_SENSOR_1  147.83,81.03 90 top
TEMP_SENSOR_2  79.5,51.56 270 top
U$1  61.21,37.59 0 top
U$2  131.32,17.53 0 top
U$6  28.7,13.46 90 top
U$9  28.7,10.92 90 top
U$10  28.7,16 90 top
U$16  4.32,8.38 0 top
U$17  1.27,8.38 180 top
U$18  7.62,8.38 0 top

### Tracks (layer width: path | path; a pad name or v marks a point on that pad's centre or on a via)
3.3CSOUT  (1 unrouted)
3.3V  (6 unrouted)
3.3VEN  (1 unrouted)
5CSOUT  (1 unrouted)
5V  (32 unrouted)
12CSOUT  (1 unrouted)
12V  (6 unrouted)
12VEN  (1 unrouted)
16CSOUT  (1 unrouted)
16V  (10 unrouted)
AGND  (via drill 0.5, 0.6)  (82 unrouted)
  Top 0.254: BAT3HSOR.GND 34.29,83.32 v32.77,84.84 | v34.54,87.38 34.54,89.07 C4.2 33.95,89.66 33.27,89.66 31.92,91.02 C5.2 R30.1 | C_BYP2.2 28.63,63.17 29.21,63.75 29.21,65.78 C6.- v26.42,71.37 | HIGHSIDEMOS3.S 28.79,77.89 v28.96,77.47
  Top 0.406: 76.2,99.57 R9.1 | 76.2,99.57 v76.2,100.33 | BAT1HSOR.GND arc90 66.04,80.94 66.04,82.04 v65.28,82.04 | 76.2,99.57 79.5,99.57 C12.2 81.53,97.79 81.53,93.22 CTMR.2 | R14.1 v46.48,73.91
  Bottom 0.254: v32.77,84.84 32.77,85.6 v34.54,87.38 | v28.96,77.47 28.96,73.91 v26.42,71.37
  Bottom 0.406: v65.28,82.04 65.28,91.69 74.93,91.69 74.93,100.33 v76.2,100.33 | v46.48,73.91 41.66,73.91 arc-90 41.4,74.17 41.4,87.38 36.16,87.38 36.14,87.4 35.49,87.4 35.47,87.38 v34.54,87.38
BAT1  (via drill 0.6)  (1 unrouted)
  Top 0.406: 64.01,95 64.01,93.2 R48.2 62.48,93.14 62.48,88.9 64.01,88.9 | R5.2 64.01,95 | 64.01,95 BAT1.P$2 50.8,95 | 50.8,95 BAT1.P$1 | 50.8,95 HSOR1MOS1.DRAIN | BAT1HSOR.VCC 69.85,76.1 v69.85,88.9 | v66.29,88.9 64.01,88.9 | 64.01,88.9 R10.2
  Route15 0.406: v69.85,88.9 v66.29,88.9
  other vias: 47.05,95
BAT1CSOUT  (1 unrouted)
BAT1HSOROUT  (1 unrouted)
  Top 0.305: BAT1HSOR.OUT BAT1HSOR.SENSE
  Top 0.406: 55.37,68.58 C15.+ 55.63,63.13 arc-90 BAT1CS.P$1 | 55.37,68.58 HSOR1MOS2.DRAIN 55.37,76.1 BAT1HSOR.OUT | R13.2 55.37,68.58
BAT2  (7 unrouted)
BAT2CSOUT  (1 unrouted)
BAT2HSOROUT  (5 unrouted)
  Top 0.406: BAT2HSOR.SENSE BAT2HSOR.OUT
BAT3  (via drill 0.5)  (1 unrouted)
  Top 0.254: HSOR3MOS1.DRAIN 12.7,95 SHORE.P$1 SHORE.P$2 17.46,95.5 23.62,95.5 24.73,94.4 R24.2 R29.2 25.57,90.68 24.13,90.68 23.62,90.17 23.62,88.39 25.91,86.11 R50.2 26,85.85 v27.43,85.85 | v36.83,76.2 36.43,76.6 BAT3HSOR.VCC
  Route15 0.254: v27.43,85.85 29.46,83.82 36.83,83.82 v36.83,76.2
  pour Top: 0.25,101.35 0.25,85.6 23.88,85.6 23.88,101.35
BAT3HSOROUT
  Top 0.254: 16.52,72.98 C6.+ 16.5,71.36 BAT3CS.P$1 BAT3CS.P$2 | 16.52,72.98 HSOR3MOS2.DRAIN | 16.52,72.98 21.93,72.98 24.89,75.95 31.63,75.95 | 31.63,75.95 BAT3HSOR.OUT BAT3HSOR.SENSE | 31.63,75.95 31.63,72.36 R32.2
  pour Top: 0.51,78.23 21.59,78.23 21.59,66.29 18.29,66.29 18.29,62.48 0.25,62.48 0.25,78.23
DGND  (25 unrouted)
INT_SCL  (2 unrouted)
INT_SDA  (2 unrouted)
N$2  (2 unrouted)
N$3
  Top 0.406: HSOR1MOS1.GATE 61.21,85.21 R3.2
N$4  (2 unrouted)
N$6  (1 unrouted)
N$7  (via drill 0.6)
  Top 0.406: R3.1 D1.C 61.21,78.74 v68.83,78.74 | v70.87,78.74 70.87,74.93 66.55,74.93 BAT1HSOR.HGATE
  Route15 0.406: v68.83,78.74 v70.87,78.74
N$8
  Top 0.406: R5.1 R6.2
N$9  (via drill 0.6)
  Top 0.406: HSOR1MOS2.GATE 54.4,78.49 D2.C 48.51,78.49 v48.51,76.96 | v64.77,74.17 65.48,75.18 BAT1HSOR.DGATE
  Route15 0.406: v48.51,76.96 48.51,74.17 v64.77,74.17
N$10  (1 unrouted)
N$11
  Top 0.254: HSOR3MOS2.SOURCE2 HSOR3MOS1.SOURCE3 HSOR3MOS1.SOURCE2 | HSOR3MOS2.SOURCE2 HSOR3MOS2.SOURCE1 17.73,78.87 D5.A | HSOR3MOS2.SOURCE2 HSOR3MOS2.SOURCE3 | D5.A 16.56,81.03 HSOR3MOS1.SOURCE2 | HSOR3MOS1.SOURCE1 HSOR3MOS1.SOURCE2 | D5.A 19.89,80.44 23.62,76.71 30.23,76.71 31.75,78.23 33.53,78.23 34.29,77.47 BAT3HSOR.SOURCE
  pour Top (rank 2): 0.51,85.34 0.51,78.49 21.34,78.49 21.34,85.34
N$12
  Top 0.406: R6.1 R7.2
N$13
  Top 0.406: R7.1 R8.2
N$14  (via drill 0.6)
  Top 0.406: v68.83,84.58 68.83,92.71 73.15,92.71 R8.1 R9.2 C12.1 | v66.22,84.58 66.48,84.33 BAT1HSOR.OV
  Route15 0.406: v68.83,84.58 v66.22,84.58
N$15  (2 unrouted)
  Top 0.406: BAT1HSOR.UV 67.06,82.65 67.06,87.12 64.01,87.12 R10.1
N$16
  Top 0.406: R13.1 R12.2
N$17  (via drill 0.6)
  Top 0.406: R12.1 R14.2 arc90 50.29,74.08 v50.29,75.69 | v62.74,79.76 62.74,80.77 arc-90 62.84,80.88 BAT1HSOR.FB
  Route15 0.406: v50.29,75.69 50.29,79.76 v62.74,79.76
N$18  (1 unrouted)
N$19  (2 unrouted)
  Top 0.406: R17.2 C1.1
N$20  (via drill 0.6)
  Top 0.406: CTMR.1 77.38,91.61 76.2,90.42 v70.87,90.42 | v63.5,83.31 64.52,82.3 BAT1HSOR.TMR
  Route15 0.406: v70.87,90.42 70.87,83.31 v63.5,83.31
N$21  (3 unrouted)
N$22  (1 unrouted)
  Top 0.305: R20.2 97.62,65.19 | 96.01,68.49 R21.1
N$23  (2 unrouted)
N$24  (1 unrouted)
N$25  (1 unrouted)
N$26  (1 unrouted)
N$27  (4 unrouted)
  Top 0.406: HSOR2MOS1.SOURCE1 HSOR2MOS1.SOURCE2 HSOR2MOS1.SOURCE3 | HSOR2MOS2.SOURCE3 HSOR2MOS2.SOURCE2 HSOR2MOS2.SOURCE1
N$28  (1 unrouted)
N$29  (1 unrouted)
N$30
  Top 0.254: R23.1 22.61,81.21 D5.C 25.65,81.03 26.16,80.52 28.96,80.52 30.23,79.25 33.78,79.25 34.8,78.23 34.8,76.62 BAT3HSOR.HGATE
N$31  (via drill 0.5, 0.6)
  Top 0.254: BAT3HSOR.DGATE 33.79,75.19 v33.53,74.93
  Top 0.406: HSOR3MOS2.GATE v9.91,78.87 9.27,79.5 D6.C
  Route15 0.254: v33.53,74.93 33.53,75.18 30.23,78.49 10.29,78.49
  Route15 0.406: 10.29,78.49 v9.91,78.87
N$32  (2 unrouted)
N$33
  Top 0.254: R25.2 R24.1
N$34
  Top 0.254: R25.1 R26.2
N$35
  Top 0.254: R26.1 R27.2
N$36  (via drill 0.5)
  Top 0.254: R27.1 C4.1 | C4.1 35.81,92.54 35.81,95.76 36.16,96.1 R28.2 | C4.1 35.47,91.02 36.32,90.17 36.32,87.12 v35.81,86.61 | v34.29,85.09 34.29,84.33 34.8,83.82 34.8,81.4 BAT3HSOR.OV
  Route15 0.254: v35.81,86.61 v34.29,85.09
N$37
  Top 0.254: R29.1 R30.2 C5.1 35.29,85.53 BAT3HSOR.UV
N$38  (1 unrouted)
N$39  (1 unrouted)
  Top 0.406: 67.49,91.36 BAT1HSOR.SHDN | 67.49,91.36 63.95,91.36 R48.1 | HIGHSIDEMOS1.D 67.56,91.95 arc-90 67.49,91.77 67.49,91.36
N$40  (via drill 0.5)  (1 unrouted)
  Top 0.254: R31.1 29.97,69.6 29.46,70.1 29.46,73.66 v30.73,74.93 | v30.73,81.28 32.18,81.28 BAT3HSOR.FB
  Route2 0.254: v30.73,74.93 v30.73,81.28
N$42
  Top 0.254: CTMR2.1 37.5,78.49 35.56,78.49 34.29,79.76 32.77,79.76 32.79,79.78 BAT3HSOR.TMR
N$44
  Top 0.254: HSOR3MOS1.GATE 21.88,85.21 R23.2
N$45  (1 unrouted)
N$46  (6 unrouted)
N$47  (1 unrouted)
N$48  (4 unrouted)
N$49  (1 unrouted)
N$50  (4 unrouted)
N$51  (1 unrouted)
N$52  (2 unrouted)
N$53  (1 unrouted)
N$54  (3 unrouted)
N$55  (2 unrouted)
N$56  (via drill 0.5)
  Top 0.254: R50.1 25.91,82.04 v26.42,81.53 | 26.86,79.5 v25.4,79.5 26.86,79.5 | 26.86,79.5 HIGHSIDEMOS3.D | HIGHSIDEMOS3.D 26.86,79.5 | HIGHSIDEMOS3.D 27.75,79.76 v28.45,79.76 | v35.81,80.01 35.79,80.04 BAT3HSOR.SHDN
  Route15 0.254: v26.42,81.53 26.42,80.52 v25.4,79.5 | v28.45,79.76 28.7,80.01 v35.81,80.01
N$57  (2 unrouted)
N$59  (2 unrouted)
N$62  (1 unrouted)
N$64  (1 unrouted)
N$65  (1 unrouted)
N$66  (2 unrouted)
N$67  (1 unrouted)
N$68  (via drill 0.6)
  Top 0.406: HSOR1MOS1.SOURCE3 HSOR1MOS1.SOURCE2 HSOR1MOS1.SOURCE1 49.78,85.21 49.78,81.28 | D2.A 45.54,81.28 49.78,81.28 | 55.05,81.28 HSOR1MOS2.SOURCE3 HSOR1MOS2.SOURCE2 HSOR1MOS2.SOURCE1 | 55.05,81.28 D1.A 58.24,77.47 v68.83,77.47 | 49.78,81.28 55.05,81.28 | 66.04,76.1 BAT1HSOR.SOURCE 65.99,74.7 66,74.69 66,74.67 66.04,74.63 66.04,74.17 71.88,74.17 v71.88,77.47
  Route15 0.406: v68.83,77.47 v71.88,77.47
N$69  (1 unrouted)
N$70  (1 unrouted)
N$71  (2 unrouted)
N$72  (2 unrouted)
N$73  (2 unrouted)
N$74  (2 unrouted)
N$83  (1 unrouted)
N$87  (1 unrouted)
N$88  (1 unrouted)
N$89  (1 unrouted)
N$90  (1 unrouted)
N$92  (1 unrouted)
N$95  (1 unrouted)
N$96  (1 unrouted)
N$97  (1 unrouted)
OR1EN  (1 unrouted)
OR2EN  (1 unrouted)
OR3EN  (1 unrouted)
SHORECSOUT  (1 unrouted)
TEMP1  (1 unrouted)
TEMP2  (1 unrouted)
UWEEN  (1 unrouted)
VIN  (14 unrouted)
  Top 0.406: BAT3CS.P$3 BAT3CS.P$4